# Altium schematic sheet RS232_M_V1.SchDoc
size A4
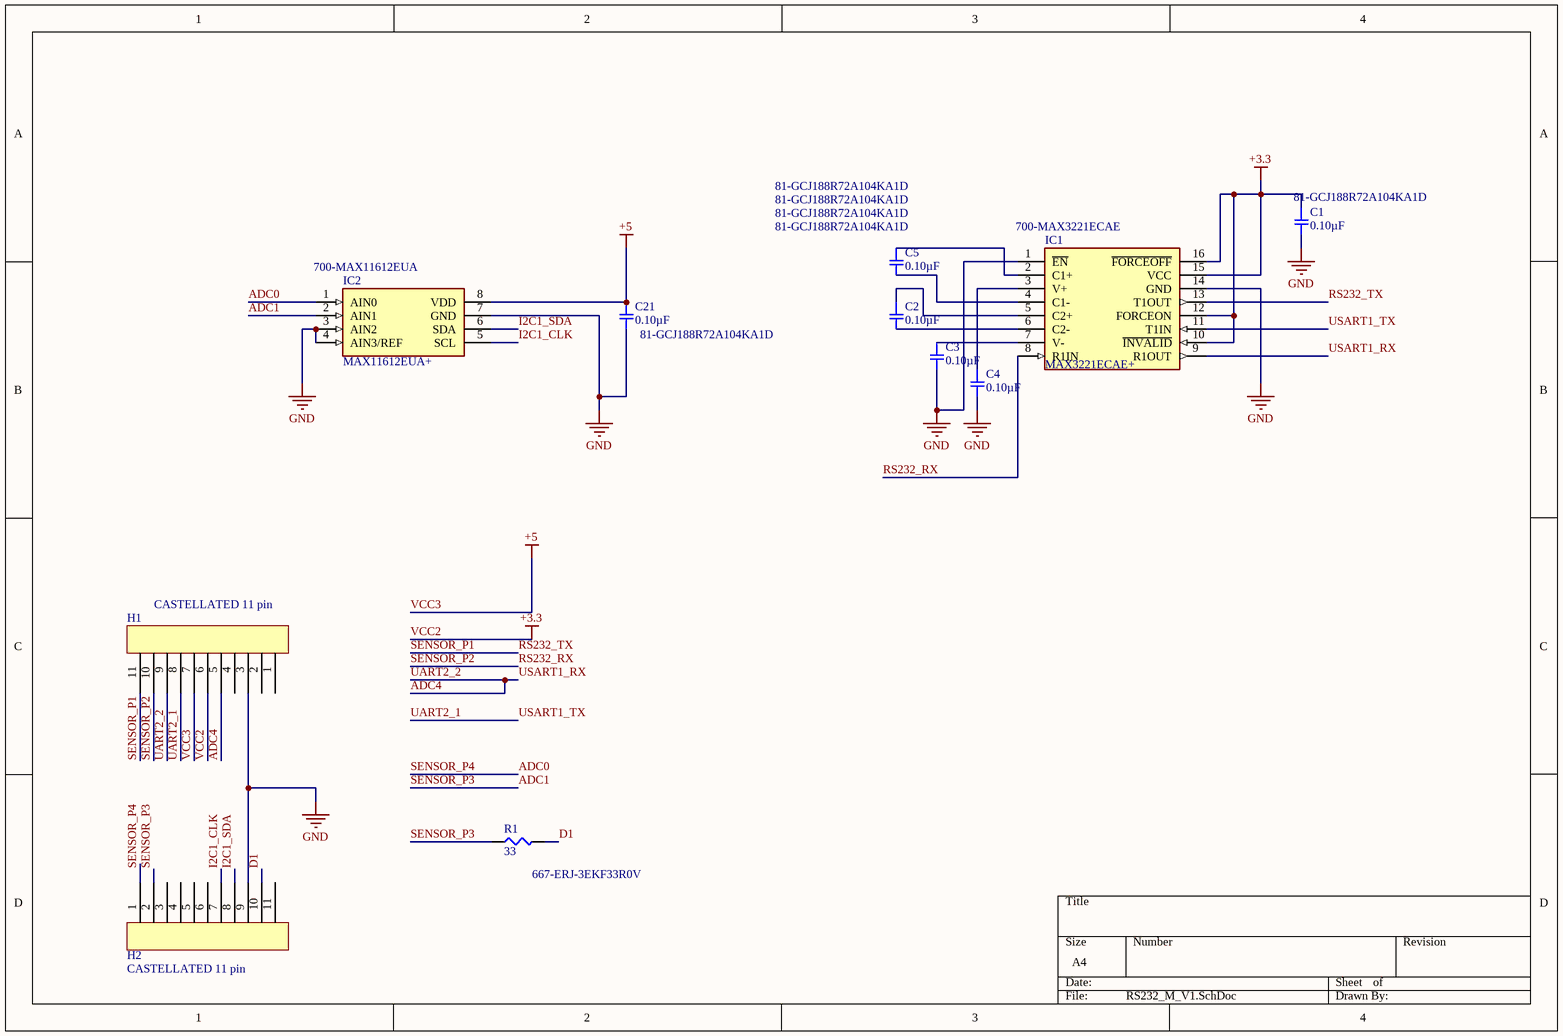
[diagram p0: RS232_M_V1.SchDoc]

## Parts
C1  0.10µF  Supplier Part Number 1: 81-GCJ188R72A104KA1D  [SMD-0603C]
C2  0.10µF  Supplier Part Number 1: 81-GCJ188R72A104KA1D  [SMD-0603C]
C3  0.10µF  Supplier Part Number 1: 81-GCJ188R72A104KA1D  [SMD-0603C]
C4  0.10µF  Supplier Part Number 1: 81-GCJ188R72A104KA1D  [SMD-0603C]
C5  0.10µF  Supplier Part Number 1: 81-GCJ188R72A104KA1D  [SMD-0603C]
C21  0.10µF  Supplier Part Number 1: 81-GCJ188R72A104KA1D  [SMD-0603C]
H1  CASTELLATED 11 pin  [CASTELLATED 11 pin]
H2  CASTELLATED 11 pin  [CASTELLATED 11 pin]
IC1  MAX3221ECAE+  Supplier Part Number 1: 700-MAX3221ECAE  [SOP65P778X199-16N]
IC2  MAX11612EUA+  Supplier Part Number 1: 700-MAX11612EUA  [SOP65P490X110-8N]
R1  33  Supplier Part Number 1: 667-ERJ-3EKF33R0V  [SMD-0603-RES]

## Nets
GND: C1.2 C3.2 C4.2 C21.2 H1.3 H2.9 IC1.1(~{EN}) IC1.14(GND) IC2.3(AIN2) IC2.4(AIN3/REF) IC2.7(GND)
VCC2: C1.1 H1.6 IC1.10(~{INVALID}) IC1.12(FORCEON) IC1.15(VCC) IC1.16(~{FORCEOFF})  [also labelled +3.3]
VCC3: C21.1 H1.7 IC2.8(VDD)  [also labelled +5]
ADC0: H2.1 IC2.1(AIN0)  [also labelled SENSOR_P4]
ADC1: H2.2 IC2.2(AIN1) R1.1  [also labelled SENSOR_P3]
ADC4: H1.5 H1.9 IC1.9(R1OUT)  [also labelled UART2_2, USART1_RX]
D1: H2.10 R1.2
I2C1_CLK: H2.7 IC2.5(SCL)
I2C1_SDA: H2.8 IC2.6(SDA)
RS232_RX: H1.10 IC1.8(R1IN)  [also labelled SENSOR_P2]
RS232_TX: H1.11 IC1.13(T1OUT)  [also labelled SENSOR_P1]
UART2_1: H1.8 IC1.11(T1IN)  [also labelled USART1_TX]
NetC2_1: C2.1 IC1.5(C2+)
NetC2_2: C2.2 IC1.6(C2-)
NetC3_1: C3.1 IC1.7(V-)
NetC4_1: C4.1 IC1.3(V+)
NetC5_1: C5.1 IC1.2(C1+)
NetC5_2: C5.2 IC1.4(C1-)

Not connected (* = marked no-connect by the designer): H1 1 2 4; H2 3 4 5 6 11

## Library data of the parts
C1-C5 C21 = GCJ188R72A104KA01D: CAP CER 0.1UF 100V X7R 0603; Manufacturer: Murata Electronics North America; Factory Stock: 0; Unit Price (USD): 0,23; Minimum Quantity: 1; Tolerance: ±10%; Part Number: GCJ188R72A104KA01D; Datasheets: http://www.murata.com/~/media/webrenewal/support/library/catalog/products/capacitor/mlcc/c03e.ashx; Image: //media.digikey.com/Renders/Murata%20Renders/0603%28LQG18%29.jpg; Digi-Key Part Number: 490-13420-1-ND; Quantity Available: 2728; @ qty: 0; Packaging: Cut Tape (CT); Series: GCJ; Part Status: Active; Value: 0.10µF; Voltage: 100V; Temperature Coefficient: X7R; Operating Temperature: -55°C ~ 125°C; Features: Soft Termination; Ratings: AEC-Q200; Applications: Automotive, Boardflex Sensitive; Mounting Type: Surface Mount, MLCC; Package / Case: 0603 (1608 Metric); Size / Dimension: 0.063" L x 0.031" W (1.60mm x 0.80mm); Height - Seated (Max): -; Thickness (Max): 0.035" (0.90mm); Lead Spacing: -; Lead Style: -; Supplier 1: Mouser
IC1 = MAX3221ECAE+: Integrated Circuit; Manufacturer_Name: Maxim Integrated; Datasheet Link: http://datasheets.maximintegrated.com/en/ds/MAX3221E-MAX3243E.pdf; Height: 1.99mm; Manufacturer_Part_Number: MAX3221ECAE+; Supplier 1: Mouser
IC2 = MAX11612EUA+: Integrated Circuit; Supplier 1: Mouser
R1 = ERJ-3EKF33R0V: RES SMD 33 OHM 1% 1/10W 0603; Manufacturer: Panasonic Electronic Components; Factory Stock: 0; Unit Price (USD): 0.00379; @ qty: 1500; Minimum Quantity: 1; Power (Watts): 0.1W, 1/10W; Temperature Coefficient: ±100ppm/°C; Part Number: ERJ-3EKF33R0V; Datasheets: http://industrial.panasonic.com/www-cgi/jvcr13pz.cgi?E+PZ+3+AOA0002+ERJ3EKF33R0V+7+WW; Image: //media.digikey.com/Photos/Panasonic%20Photos/MFG_ERJ-P6W%20Series.jpg; Digi-Key Part Number: P33.0HCT-ND; Quantity Available: 1306721; Packaging: Cut Tape (CT); Series: ERJ; Part Status: Active; Value: 33; Tolerance: ±1%; Composition: Thick Film; Features: Automotive AEC-Q200; Operating Temperature: -55°C ~ 155°C; Package / Case: 0603 (1608 Metric); Supplier Device Package: 0603; Size / Dimension: 0.063" L x 0.031" W (1.60mm x 0.80mm); Height - Seated (Max): 0.022" (0.55mm); Number of Terminations: 2; Failure Rate: -; Supplier 1: Mouser